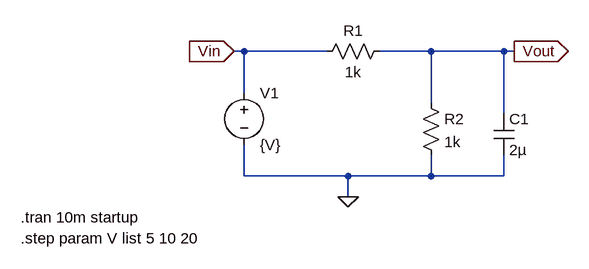
[diagram p0: schematic Draft4.asc]
Draft4.asc, the LTspice schematic file:
Version 4
SHEET 1 880 680
WIRE -16 64 -32 64
WIRE 112 64 -16 64
WIRE 272 64 192 64
WIRE 384 64 272 64
WIRE 400 64 384 64
WIRE -16 128 -16 64
WIRE 272 144 272 64
WIRE 384 160 384 64
WIRE -16 256 -16 208
WIRE 144 256 -16 256
WIRE 272 256 272 224
WIRE 272 256 144 256
WIRE 384 256 384 224
WIRE 384 256 272 256
WIRE 144 288 144 256
FLAG 144 288 0
FLAG -32 64 Vin
IOPIN -32 64 In
FLAG 400 64 Vout
IOPIN 400 64 Out
SYMBOL res 208 48 R90
WINDOW 0 0 56 VBottom 2
WINDOW 3 32 56 VTop 2
SYMATTR InstName R1
SYMATTR Value 1k
SYMBOL res 256 128 R0
SYMATTR InstName R2
SYMATTR Value 1k
SYMBOL cap 368 160 R0
SYMATTR InstName C1
SYMATTR Value 2µ
SYMBOL voltage -16 112 R0
WINDOW 123 0 0 Left 0
WINDOW 39 0 0 Left 0
SYMATTR InstName V1
SYMATTR Value {V}
TEXT -360 320 Left 2 !.tran 10m startup
TEXT -360 352 Left 2 !.step param V list 5 10 20

The netlist it stands for:
* Draft4.asc
R1 Vout Vin 1k
R2 Vout 0 1k
C1 Vout 0 2µ
V1 Vin 0 {V}
.tran 10m startup
.step param V list 5 10 20
.backanno
.end

* Results of the author's LTspice run, read from the files saved beside the schematic
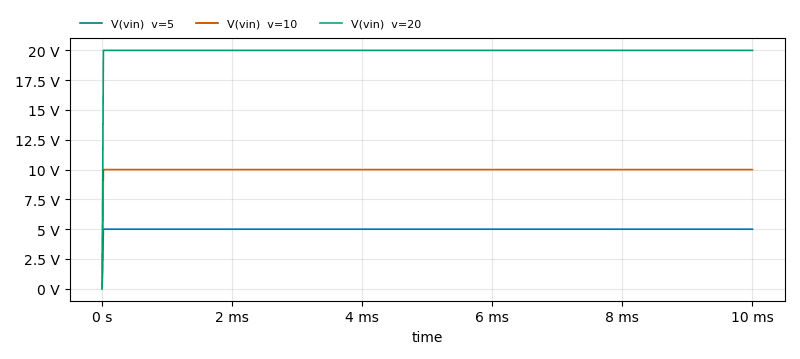
[diagram p1: Transient Analysis of Draft4.asc, plotted from the saved traces]
* Transient Analysis, 3 runs:
*   V(vin) [v=5]: min 0 V, max 5 V, average 4.995 V, rms 4.997 V, last 5 V
*   V(vin) [v=10]: min 0 V, max 10 V, average 9.99 V, rms 9.993 V, last 10 V
*   V(vin) [v=20]: min 0 V, max 20 V, average 19.98 V, rms 19.99 V, last 20 V